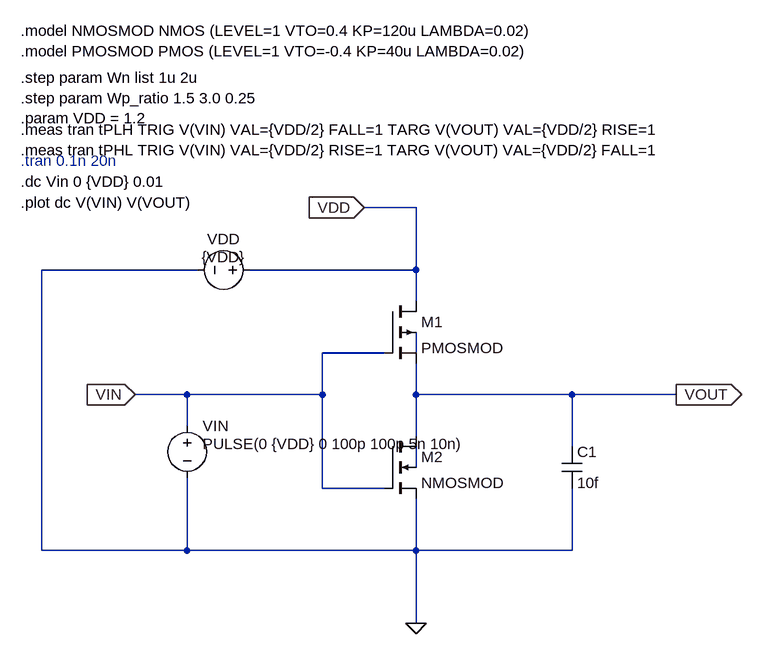
[diagram p0: schematic inverter_WL_sweep.asc]
inverter_WL_sweep.asc, the LTspice schematic file:
Version 4.1
SHEET 1 880 680
WIRE 256 -192 176 -192
WIRE -80 -96 -320 -96
WIRE 256 -96 256 -192
WIRE 256 -96 0 -96
WIRE 256 -48 256 -96
WIRE 208 32 112 32
WIRE 256 32 256 0
WIRE -96 96 -176 96
WIRE 112 96 112 32
WIRE 112 96 -96 96
WIRE 256 96 256 48
WIRE 496 96 256 96
WIRE 656 96 496 96
WIRE -96 144 -96 96
WIRE 256 160 256 96
WIRE 496 176 496 96
WIRE 256 208 256 176
WIRE 112 240 112 96
WIRE 208 240 112 240
WIRE -320 336 -320 -96
WIRE -96 336 -96 224
WIRE -96 336 -320 336
WIRE 256 336 256 256
WIRE 256 336 -96 336
WIRE 496 336 496 240
WIRE 496 336 256 336
WIRE 256 448 256 336
FLAG -176 96 VIN
IOPIN -176 96 In
FLAG 656 96 VOUT
IOPIN 656 96 Out
FLAG 176 -192 VDD
IOPIN 176 -192 In
FLAG 256 448 0
SYMBOL voltage 16 -96 R90
WINDOW 0 -32 56 VBottom 2
WINDOW 3 -4 56 VBottom 2
WINDOW 123 0 0 Left 0
WINDOW 39 0 0 Left 0
SYMATTR InstName VDD
SYMATTR Value {VDD}
SYMBOL voltage -96 128 R0
WINDOW 3 24 44 Left 2
WINDOW 123 0 0 Left 0
WINDOW 39 0 0 Left 0
SYMATTR InstName VIN
SYMATTR Value PULSE(0 {VDD} 0 100p 100p 5n 10n)
SYMBOL cap 480 176 R0
SYMATTR InstName C1
SYMATTR Value 10f
SYMBOL pmos4 208 -48 R0
SYMATTR InstName M1
SYMATTR Value PMOSMOD
SYMATTR Value2 l=0.1u w={Wp_ratio * Wn}
SYMBOL nmos4 208 160 R0
SYMATTR InstName M2
SYMATTR Value NMOSMOD
SYMATTR Value2 l=0.1u w=Wn
TEXT -352 -464 Left 2 !.model NMOSMOD NMOS (LEVEL=1 VTO=0.4 KP=120u LAMBDA=0.02)\n.model PMOSMOD PMOS (LEVEL=1 VTO=-0.4 KP=40u LAMBDA=0.02)
TEXT -352 -392 Left 2 !.step param Wn list 1u 2u\n.step param Wp_ratio 1.5 3.0 0.25\n.param VDD = 1.2
TEXT -352 -232 Left 2 !.dc Vin 0 {VDD} 0.01
TEXT -352 -200 Left 2 !.plot dc V(VIN) V(VOUT)
TEXT -352 -264 Left 2 ;.tran 0.1n 20n
TEXT -352 -312 Left 2 !.meas tran tPLH TRIG V(VIN) VAL={VDD/2} FALL=1 TARG V(VOUT) VAL={VDD/2} RISE=1\n.meas tran tPHL TRIG V(VIN) VAL={VDD/2} RISE=1 TARG V(VOUT) VAL={VDD/2} FALL=1

The netlist it stands for:
* inverter_WL_sweep.asc
VDD VDD 0 {VDD}
VIN VIN 0 PULSE(0 {VDD} 0 100p 100p 5n 10n)
C1 VOUT 0 10f
M1 VDD VIN VOUT N001 PMOSMOD l=0.1u w={Wp_ratio * Wn}
M2 VOUT VIN 0 N002 NMOSMOD l=0.1u w=Wn
.model NMOS NMOS
.model PMOS PMOS
.lib standard.mos
.model NMOSMOD NMOS (LEVEL=1 VTO=0.4 KP=120u LAMBDA=0.02)
.model PMOSMOD PMOS (LEVEL=1 VTO=-0.4 KP=40u LAMBDA=0.02)
.step param Wn list 1u 2u
.step param Wp_ratio 1.5 3.0 0.25
.param VDD = 1.2
.dc Vin 0 {VDD} 0.01
.plot dc V(VIN) V(VOUT)
* .tran 0.1n 20n
.meas tran tPLH TRIG V(VIN) VAL={VDD/2} FALL=1 TARG V(VOUT) VAL={VDD/2} RISE=1
.meas tran tPHL TRIG V(VIN) VAL={VDD/2} RISE=1 TARG V(VOUT) VAL={VDD/2} FALL=1
.backanno
.end